# Altium schematic sheet RAM.SchDoc
size A0; SheetNumber: 7; SheetTotal: 12
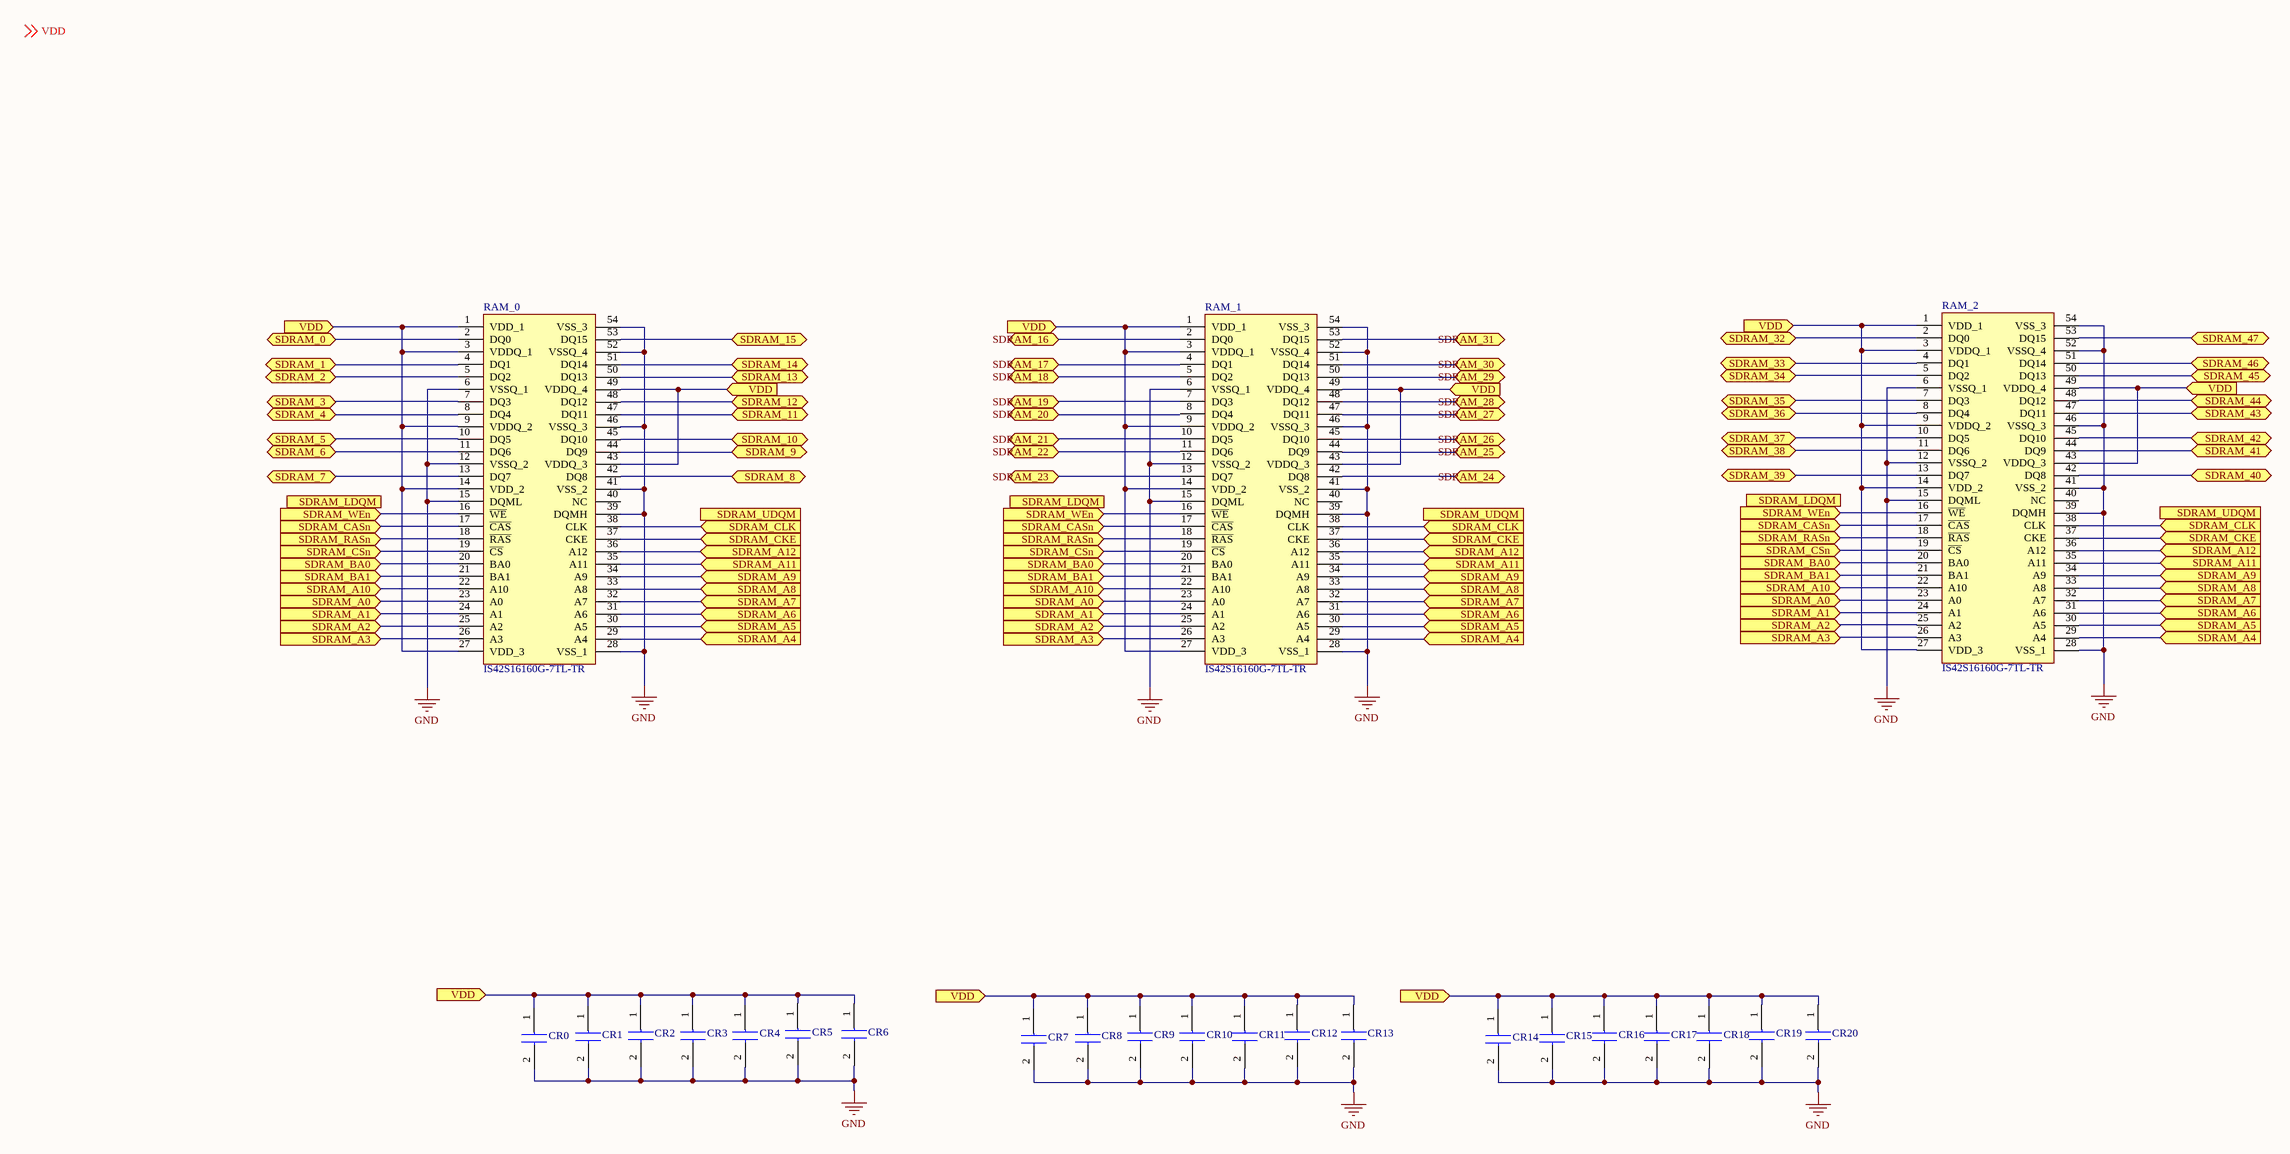
[diagram p0: RAM.SchDoc]

## Parts
CR0  GRM155R71C104JA88D  [CAPC1005X55N]  (value not drawn)
CR1  GRM155R71C104JA88D  [CAPC1005X55N]  (value not drawn)
CR2  GRM155R71C104JA88D  [CAPC1005X55N]  (value not drawn)
CR3  GRM155R71C104JA88D  [CAPC1005X55N]  (value not drawn)
CR4  GRM155R71C104JA88D  [CAPC1005X55N]  (value not drawn)
CR5  GRM155R71C104JA88D  [CAPC1005X55N]  (value not drawn)
CR6  GRM155R71C104JA88D  [CAPC1005X55N]  (value not drawn)
CR7  GRM155R71C104JA88D  [CAPC1005X55N]  (value not drawn)
CR8  GRM155R71C104JA88D  [CAPC1005X55N]  (value not drawn)
CR9  GRM155R71C104JA88D  [CAPC1005X55N]  (value not drawn)
CR10  GRM155R71C104JA88D  [CAPC1005X55N]  (value not drawn)
CR11  GRM155R71C104JA88D  [CAPC1005X55N]  (value not drawn)
CR12  GRM155R71C104JA88D  [CAPC1005X55N]  (value not drawn)
CR13  GRM155R71C104JA88D  [CAPC1005X55N]  (value not drawn)
CR14  GRM155R71C104JA88D  [CAPC1005X55N]  (value not drawn)
CR15  GRM155R71C104JA88D  [CAPC1005X55N]  (value not drawn)
CR16  GRM155R71C104JA88D  [CAPC1005X55N]  (value not drawn)
CR17  GRM155R71C104JA88D  [CAPC1005X55N]  (value not drawn)
CR18  GRM155R71C104JA88D  [CAPC1005X55N]  (value not drawn)
CR19  GRM155R71C104JA88D  [CAPC1005X55N]  (value not drawn)
CR20  GRM155R71C104JA88D  [CAPC1005X55N]  (value not drawn)
RAM_0  IS42S16160G-7TL-TR  [SOP80P1176X120-54N]
RAM_1  IS42S16160G-7TL-TR  [SOP80P1176X120-54N]
RAM_2  IS42S16160G-7TL-TR  [SOP80P1176X120-54N]

## Ports
SDRAM_0 (bidir), SDRAM_1 (bidir), SDRAM_2 (bidir), SDRAM_3 (bidir), SDRAM_4 (bidir), SDRAM_5 (bidir), SDRAM_6 (bidir), SDRAM_7 (bidir), SDRAM_8 (bidir), SDRAM_9 (bidir), SDRAM_10 (bidir), SDRAM_11 (bidir), SDRAM_12 (bidir), SDRAM_13 (bidir), SDRAM_14 (bidir), SDRAM_15 (bidir), SDRAM_16 (bidir), SDRAM_17 (bidir), SDRAM_18 (bidir), SDRAM_19 (bidir), SDRAM_20 (bidir), SDRAM_21 (bidir), SDRAM_22 (bidir), SDRAM_23 (bidir), SDRAM_24 (bidir), SDRAM_25 (bidir), SDRAM_26 (bidir), SDRAM_27 (bidir), SDRAM_28 (bidir), SDRAM_29 (bidir), SDRAM_30 (bidir), SDRAM_31 (bidir), SDRAM_32 (bidir), SDRAM_33 (bidir), SDRAM_34 (bidir), SDRAM_35 (bidir), SDRAM_36 (bidir), SDRAM_37 (bidir), SDRAM_38 (bidir), SDRAM_39 (bidir), SDRAM_40 (bidir), SDRAM_41 (bidir), SDRAM_42 (bidir), SDRAM_43 (bidir), SDRAM_44 (bidir), SDRAM_45 (bidir), SDRAM_46 (bidir), SDRAM_47 (bidir), SDRAM_A0 (in), SDRAM_A1 (in), SDRAM_A2 (in), SDRAM_A3 (in), SDRAM_A4 (in), SDRAM_A5 (in), SDRAM_A6 (in), SDRAM_A7 (in), SDRAM_A8 (in), SDRAM_A9 (in), SDRAM_A10 (in), SDRAM_A11 (in), SDRAM_A12 (in), SDRAM_BA0 (in), SDRAM_BA1 (in), SDRAM_CASn (in), SDRAM_CKE (in), SDRAM_CLK (in), SDRAM_CSn (in), SDRAM_LDQM (in), SDRAM_RASn (in), SDRAM_UDQM (in), SDRAM_WEn (in), VDD (in)

## Nets
GND: CR0.2 CR1.2 CR2.2 CR3.2 CR4.2 CR5.2 CR6.2 CR7.2 CR8.2 CR9.2 CR10.2 CR11.2 CR12.2 CR13.2 CR14.2 CR15.2 CR16.2 CR17.2 CR18.2 CR19.2 CR20.2 RAM_0.6(VSSQ_1) RAM_0.12(VSSQ_2) RAM_0.15(DQML) RAM_0.28(VSS_1) RAM_0.39(DQMH) RAM_0.41(VSS_2) RAM_0.46(VSSQ_3) RAM_0.52(VSSQ_4) RAM_0.54(VSS_3) RAM_1.6(VSSQ_1) RAM_1.12(VSSQ_2) RAM_1.15(DQML) RAM_1.28(VSS_1) RAM_1.39(DQMH) RAM_1.41(VSS_2) RAM_1.46(VSSQ_3) RAM_1.52(VSSQ_4) RAM_1.54(VSS_3) RAM_2.6(VSSQ_1) RAM_2.12(VSSQ_2) RAM_2.15(DQML) RAM_2.28(VSS_1) RAM_2.39(DQMH) RAM_2.41(VSS_2) RAM_2.46(VSSQ_3) RAM_2.52(VSSQ_4) RAM_2.54(VSS_3)
SDRAM_0: RAM_0.2(DQ0) ; port SDRAM_0
SDRAM_1: RAM_0.4(DQ1) ; port SDRAM_1
SDRAM_2: RAM_0.5(DQ2) ; port SDRAM_2
SDRAM_3: RAM_0.7(DQ3) ; port SDRAM_3
SDRAM_4: RAM_0.8(DQ4) ; port SDRAM_4
SDRAM_5: RAM_0.10(DQ5) ; port SDRAM_5
SDRAM_6: RAM_0.11(DQ6) ; port SDRAM_6
SDRAM_7: RAM_0.13(DQ7) ; port SDRAM_7
SDRAM_8: RAM_0.42(DQ8) ; port SDRAM_8
SDRAM_9: RAM_0.44(DQ9) ; port SDRAM_9
SDRAM_10: RAM_0.45(DQ10) ; port SDRAM_10
SDRAM_11: RAM_0.47(DQ11) ; port SDRAM_11
SDRAM_12: RAM_0.48(DQ12) ; port SDRAM_12
SDRAM_13: RAM_0.50(DQ13) ; port SDRAM_13
SDRAM_14: RAM_0.51(DQ14) ; port SDRAM_14
SDRAM_15: RAM_0.53(DQ15) ; port SDRAM_15
SDRAM_16: RAM_1.2(DQ0) ; port SDRAM_16
SDRAM_17: RAM_1.4(DQ1) ; port SDRAM_17
SDRAM_18: RAM_1.5(DQ2) ; port SDRAM_18
SDRAM_19: RAM_1.7(DQ3) ; port SDRAM_19
SDRAM_20: RAM_1.8(DQ4) ; port SDRAM_20
SDRAM_21: RAM_1.10(DQ5) ; port SDRAM_21
SDRAM_22: RAM_1.11(DQ6) ; port SDRAM_22
SDRAM_23: RAM_1.13(DQ7) ; port SDRAM_23
SDRAM_24: RAM_1.42(DQ8) ; port SDRAM_24
SDRAM_25: RAM_1.44(DQ9) ; port SDRAM_25
SDRAM_26: RAM_1.45(DQ10) ; port SDRAM_26
SDRAM_27: RAM_1.47(DQ11) ; port SDRAM_27
SDRAM_28: RAM_1.48(DQ12) ; port SDRAM_28
SDRAM_29: RAM_1.50(DQ13) ; port SDRAM_29
SDRAM_30: RAM_1.51(DQ14) ; port SDRAM_30
SDRAM_31: RAM_1.53(DQ15) ; port SDRAM_31
SDRAM_32: RAM_2.2(DQ0) ; port SDRAM_32
SDRAM_33: RAM_2.4(DQ1) ; port SDRAM_33
SDRAM_34: RAM_2.5(DQ2) ; port SDRAM_34
SDRAM_35: RAM_2.7(DQ3) ; port SDRAM_35
SDRAM_36: RAM_2.8(DQ4) ; port SDRAM_36
SDRAM_37: RAM_2.10(DQ5) ; port SDRAM_37
SDRAM_38: RAM_2.11(DQ6) ; port SDRAM_38
SDRAM_39: RAM_2.13(DQ7) ; port SDRAM_39
SDRAM_40: RAM_2.42(DQ8) ; port SDRAM_40
SDRAM_41: RAM_2.44(DQ9) ; port SDRAM_41
SDRAM_42: RAM_2.45(DQ10) ; port SDRAM_42
SDRAM_43: RAM_2.47(DQ11) ; port SDRAM_43
SDRAM_44: RAM_2.48(DQ12) ; port SDRAM_44
SDRAM_45: RAM_2.50(DQ13) ; port SDRAM_45
SDRAM_46: RAM_2.51(DQ14) ; port SDRAM_46
SDRAM_47: RAM_2.53(DQ15) ; port SDRAM_47
SDRAM_A0: RAM_0.23(A0) RAM_1.23(A0) RAM_2.23(A0) ; port SDRAM_A0
SDRAM_A1: RAM_0.24(A1) RAM_1.24(A1) RAM_2.24(A1) ; port SDRAM_A1
SDRAM_A2: RAM_0.25(A2) RAM_1.25(A2) RAM_2.25(A2) ; port SDRAM_A2
SDRAM_A3: RAM_0.26(A3) RAM_1.26(A3) RAM_2.26(A3) ; port SDRAM_A3
SDRAM_A4: RAM_0.29(A4) RAM_1.29(A4) RAM_2.29(A4) ; port SDRAM_A4
SDRAM_A5: RAM_0.30(A5) RAM_1.30(A5) RAM_2.30(A5) ; port SDRAM_A5
SDRAM_A6: RAM_0.31(A6) RAM_1.31(A6) RAM_2.31(A6) ; port SDRAM_A6
SDRAM_A7: RAM_0.32(A7) RAM_1.32(A7) RAM_2.32(A7) ; port SDRAM_A7
SDRAM_A8: RAM_0.33(A8) RAM_1.33(A8) RAM_2.33(A8) ; port SDRAM_A8
SDRAM_A9: RAM_0.34(A9) RAM_1.34(A9) RAM_2.34(A9) ; port SDRAM_A9
SDRAM_A10: RAM_0.22(A10) RAM_1.22(A10) RAM_2.22(A10) ; port SDRAM_A10
SDRAM_A11: RAM_0.35(A11) RAM_1.35(A11) RAM_2.35(A11) ; port SDRAM_A11
SDRAM_A12: RAM_0.36(A12) RAM_1.36(A12) RAM_2.36(A12) ; port SDRAM_A12
SDRAM_BA0: RAM_0.20(BA0) RAM_1.20(BA0) RAM_2.20(BA0) ; port SDRAM_BA0
SDRAM_BA1: RAM_0.21(BA1) RAM_1.21(BA1) RAM_2.21(BA1) ; port SDRAM_BA1
SDRAM_CASn: RAM_0.17(~{CAS}) RAM_1.17(~{CAS}) RAM_2.17(~{CAS}) ; port SDRAM_CASn
SDRAM_CKE: RAM_0.37(CKE) RAM_1.37(CKE) RAM_2.37(CKE) ; port SDRAM_CKE
SDRAM_CLK: RAM_0.38(CLK) RAM_1.38(CLK) RAM_2.38(CLK) ; port SDRAM_CLK
SDRAM_CSn: RAM_0.19(~{CS}) RAM_1.19(~{CS}) RAM_2.19(~{CS}) ; port SDRAM_CSn
SDRAM_RASn: RAM_0.18(~{RAS}) RAM_1.18(~{RAS}) RAM_2.18(~{RAS}) ; port SDRAM_RASn
SDRAM_WEn: RAM_0.16(~{WE}) RAM_1.16(~{WE}) RAM_2.16(~{WE}) ; port SDRAM_WEn
VDD: CR0.1 CR1.1 CR2.1 CR3.1 CR4.1 CR5.1 CR6.1 CR7.1 CR8.1 CR9.1 CR10.1 CR11.1 CR12.1 CR13.1 CR14.1 CR15.1 CR16.1 CR17.1 CR18.1 CR19.1 CR20.1 RAM_0.1(VDD_1) RAM_0.3(VDDQ_1) RAM_0.9(VDDQ_2) RAM_0.14(VDD_2) RAM_0.27(VDD_3) RAM_0.43(VDDQ_3) RAM_0.49(VDDQ_4) RAM_1.1(VDD_1) RAM_1.3(VDDQ_1) RAM_1.9(VDDQ_2) RAM_1.14(VDD_2) RAM_1.27(VDD_3) RAM_1.43(VDDQ_3) RAM_1.49(VDDQ_4) RAM_2.1(VDD_1) RAM_2.3(VDDQ_1) RAM_2.9(VDDQ_2) RAM_2.14(VDD_2) RAM_2.27(VDD_3) RAM_2.43(VDDQ_3) RAM_2.49(VDDQ_4) ; port VDD

Not connected (* = marked no-connect by the designer): RAM_0 40(NC); RAM_1 40(NC); RAM_2 40(NC)

## Notes on the sheet
- Labels drawn without touching a wire or pin: VDD

## Library data of the parts
CR0-CR20 = GRM155R71C104JA88D: Capacitor; Manufacturer_Name: Murata Electronics; Datasheet Link: http://www.murata.com/~/media/webrenewal/support/library/catalog/products/capacitor/mlcc/c02e.pdf; Height: 0.55mm; Manufacturer_Part_Number: GRM155R71C104JA88D; Mouser Part Number: 81-GRM155R71C104JA8D; Mouser Price/Stock: https://www.mouser.co.uk/ProductDetail/Murata-Electronics/GRM155R71C104JA88D?qs=pwh76yelNxDjPOceoz6xEg%3D%3D; Arrow Part Number: GRM155R71C104JA88D; Arrow Price/Stock: https://www.arrow.com/en/products/grm155r71c104ja88d/murata-manufacturing?region=nac
RAM_0-RAM_2 = IS42S16160G-7TL-TR: Integrated Circuit; Manufacturer_Name: Integrated Silicon Solution Inc.; Datasheet Link: http://www.issi.com/WW/pdf/42-45S83200G-16160G.pdf; Height: 1.2mm; Manufacturer_Part_Number: IS42S16160G-7TL-TR; Mouser Part Number: 870-IS42S16160G7TLTR; Mouser Price/Stock: https://www.mouser.co.uk/ProductDetail/ISSI/IS42S16160G-7TL-TR?qs=9hm%252BDT1Jr7xnYjoaQib7SQ%3D%3D; Arrow Part Number: IS42S16160G-7TL-TR; Arrow Price/Stock: https://www.arrow.com/en/products/is42s16160g-7tl-tr/integrated-silicon-solution-inc?region=nac